# EAGLE schematic 00A-004 (EAGLE 6.3)
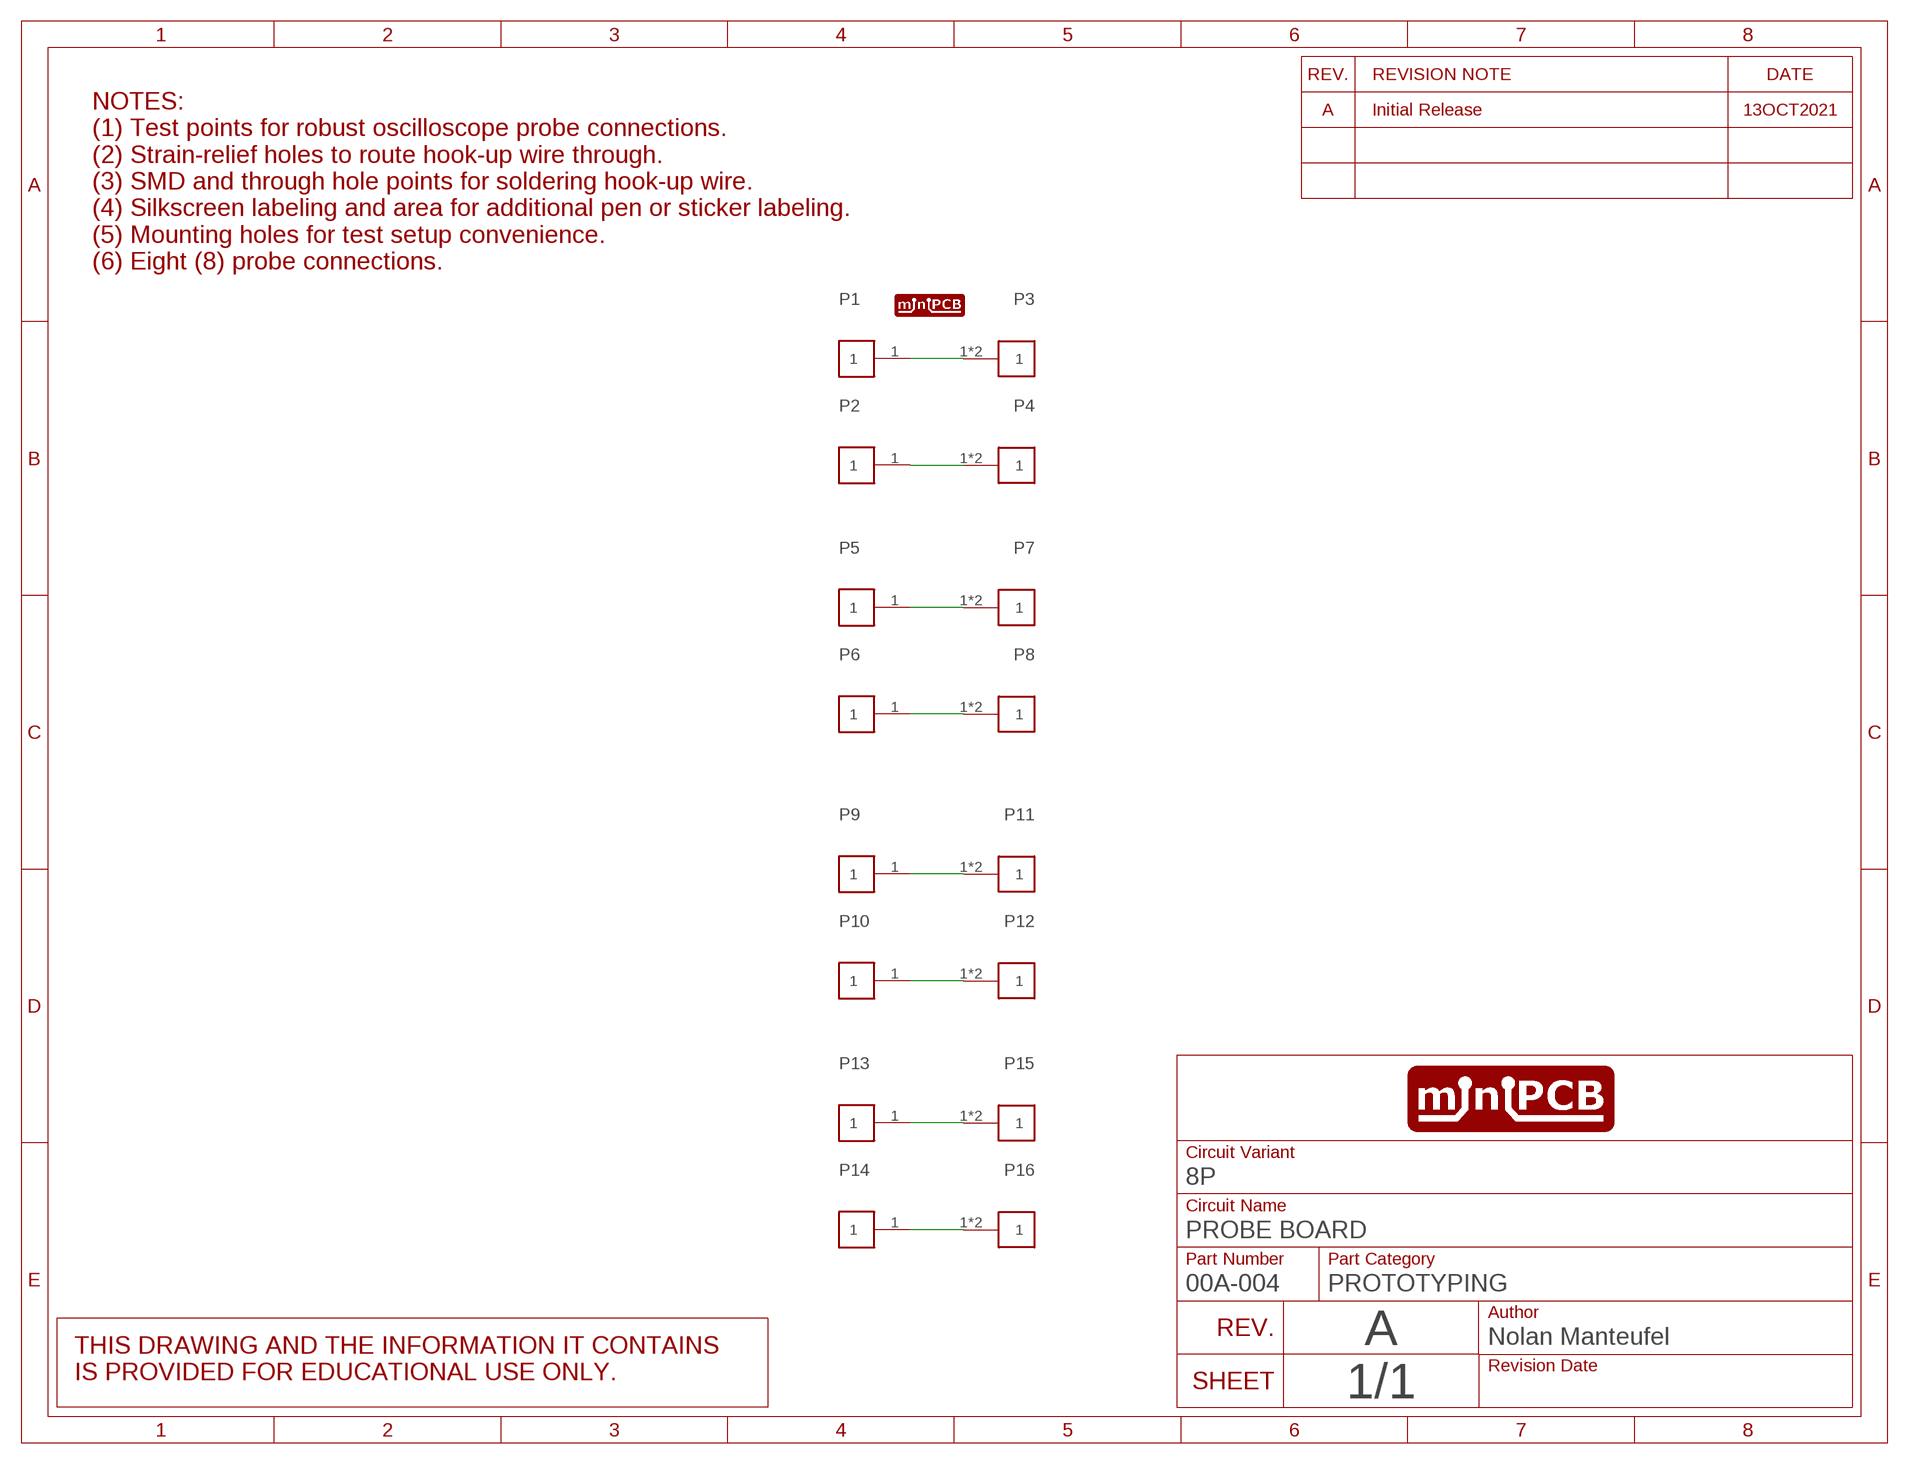
[diagram p0: schematic, sheet 1]
SHEET1 (SCHEMATIC): CIRCUIT_CATEGORY: PROTOTYPING; CIRCUIT_NAME: PROBE BOARD; REVISION: A

## Parts
P1  PINS_1KE_5000  [PINS_1_TESTPOINT_KE5000]
P2  PINS_1KE_5000  [PINS_1_TESTPOINT_KE5000]
P3  PINS_124AWG  [PINS_1_1MM]
P4  PINS_124AWG  [PINS_1_1MM]
P5  PINS_1KE_5000  [PINS_1_TESTPOINT_KE5000]
P6  PINS_1KE_5000  [PINS_1_TESTPOINT_KE5000]
P7  PINS_124AWG  [PINS_1_1MM]
P8  PINS_124AWG  [PINS_1_1MM]
P9  PINS_1KE_5000  [PINS_1_TESTPOINT_KE5000]
P10  PINS_1KE_5000  [PINS_1_TESTPOINT_KE5000]
P11  PINS_124AWG  [PINS_1_1MM]
P12  PINS_124AWG  [PINS_1_1MM]
P13  PINS_1KE_5000  [PINS_1_TESTPOINT_KE5000]
P14  PINS_1KE_5000  [PINS_1_TESTPOINT_KE5000]
P15  PINS_124AWG  [PINS_1_1MM]
P16  PINS_124AWG  [PINS_1_1MM]
U$1  MINIPCB_LOGO  [MINIPCB-LOGO]

## Nets
N$1: P1.1 P3.1 P3.2
N$2: P2.1 P4.1 P4.2
N$3: P5.1 P7.1 P7.2
N$4: P6.1 P8.1 P8.2
N$5: P9.1 P11.1 P11.2
N$6: P10.1 P12.1 P12.2
N$7: P13.1 P15.1 P15.2
N$8: P14.1 P16.1 P16.2

## Notes on the sheet
- NOTES:
  (1) Test points for robust oscilloscope probe connections.
  (2) Strain-relief holes to route hook-up wire through.
  (3) SMD and through hole points for soldering hook-up wire.
  (4) Silkscreen labeling and area for additional pen or sticker labeling.
  (5) Mounting holes for test setup convenience.
  (6) Eight (8) probe connections.
- 13OCT2021

## Library data of the parts
P1-P16 = nolan-utsa:PINS_1
U$1 = minipcb:MINIPCB_LOGO